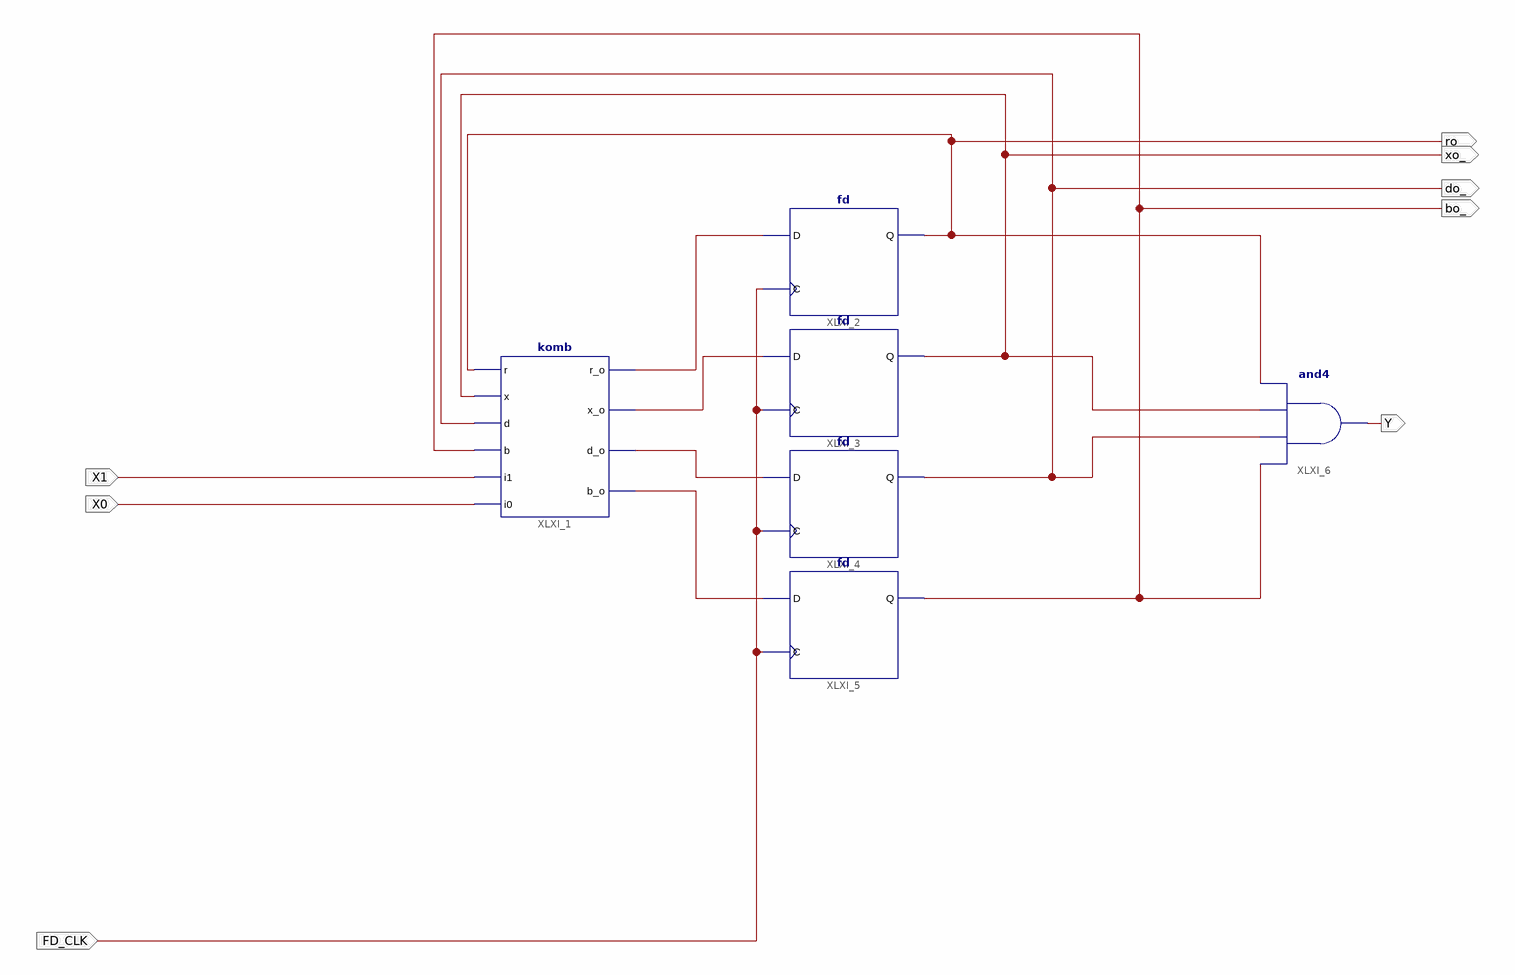
[diagram p0: schematic sheet 1]
// Xilinx ISE schematic TOP.sch (artix7) as structural Verilog: 6 symbols, 8 ports
module TOP (
  input  X1,
  input  X0,
  input  FD_CLK,
  output xo_,
  output do_,
  output bo_,
  output Y,
  output ro_
);

  wire XLXN_7, XLXN_8, XLXN_9, XLXN_10;

  komb XLXI_1 (
    .r(ro_), .x(xo_), .d(do_), .b(bo_), .i1(X1), .i0(X0), .r_o(XLXN_7), .x_o(XLXN_8), .d_o(XLXN_9),
    .b_o(XLXN_10));
  fd XLXI_2 (.C(FD_CLK), .D(XLXN_7), .Q(ro_));
  fd XLXI_3 (.C(FD_CLK), .D(XLXN_8), .Q(xo_));
  fd XLXI_4 (.C(FD_CLK), .D(XLXN_9), .Q(do_));
  fd XLXI_5 (.C(FD_CLK), .D(XLXN_10), .Q(bo_));
  and XLXI_6 (Y, bo_, do_, xo_, ro_);
endmodule
